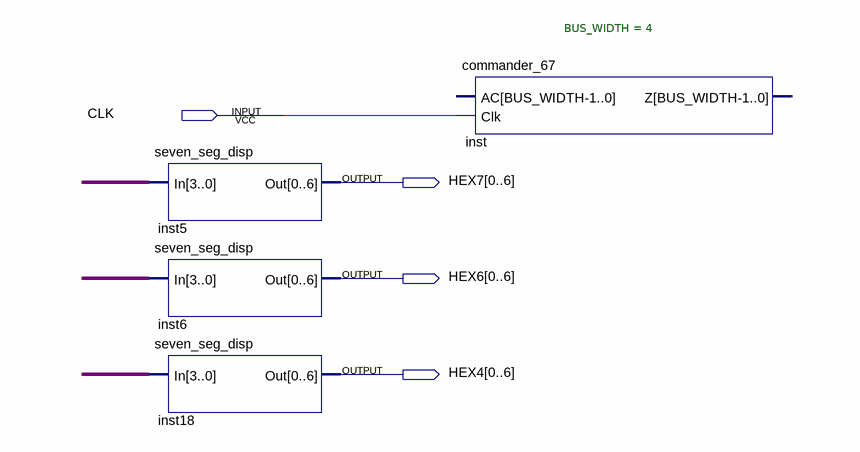
[diagram p0: schematic sheet]
// Quartus schematic commander_67_full.bdf as structural Verilog: 4 symbols, 4 pins
module commander_67_full (
  input  CLK,
  output [0:6] HEX7,
  output [0:6] HEX6,
  output [0:6] HEX4
);

  wire [3:0] undriven, undriven_2, undriven_3;

  seven_seg_disp inst5 (.In(undriven_3), .Out(HEX7));
  seven_seg_disp inst6 (.In(undriven), .Out(HEX6));
  seven_seg_disp inst18 (.In(undriven_2), .Out(HEX4));
  commander_67 #(.BUS_WIDTH(4)) inst (.Clk(CLK));  // open: AC, Z
endmodule
